# EAGLE design Power-Conversion (EAGLE 8.5.0)
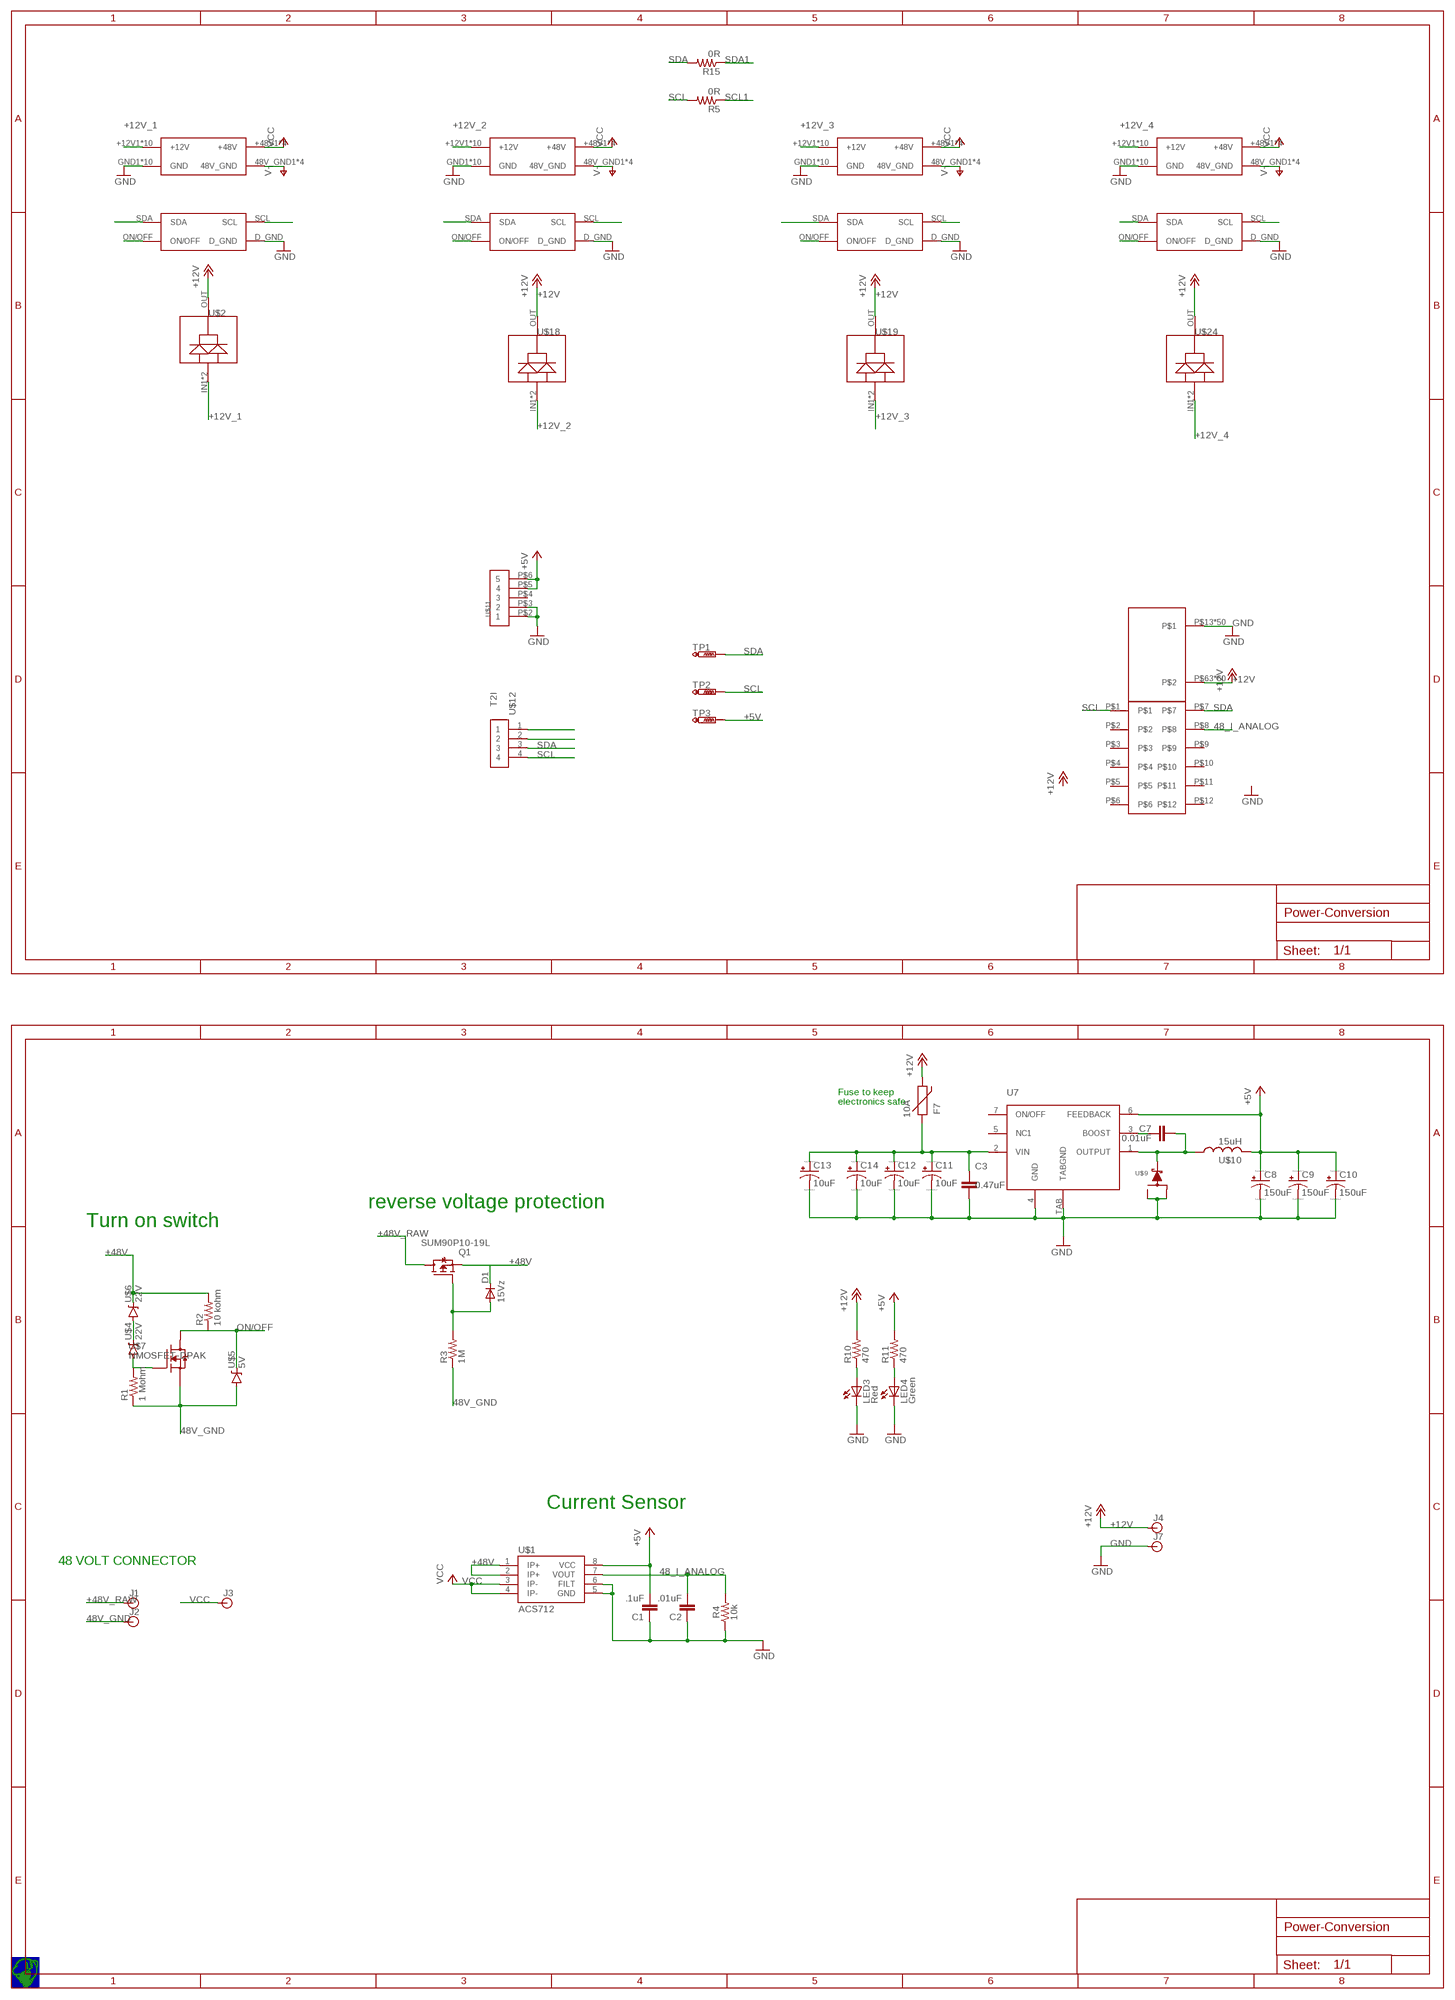
[diagram p0: schematic, sheet 1]

## Parts
C1  .1uF  4.7UF0603  [0603]
C2  .01uF  4.7UF0603  [0603]
C3  0.47uF  C-EUC0603  [C0603]
C7  0.01uF  CAP0603-CAP  [0603-CAP]
C8  150uF  C-TANTALUM(10UF_150UF)  [CTAN(7.30_4.30MM)]
C9  150uF  C-TANTALUM(10UF_150UF)  [CTAN(7.30_4.30MM)]
C10  150uF  C-TANTALUM(10UF_150UF)  [CTAN(7.30_4.30MM)]
C11  10uF  C-TANTALUM(10UF_150UF)  [CTAN(7.30_4.30MM)]
C12  10uF  C-TANTALUM(10UF_150UF)  [CTAN(7.30_4.30MM)]
C13  10uF  C-TANTALUM(10UF_150UF)  [CTAN(7.30_4.30MM)]
C14  10uF  C-TANTALUM(10UF_150UF)  [CTAN(7.30_4.30MM)]
D1  15Vz  DIODE-SOD123  [SOD123]
F7  10A  PTC(2920L)  [PTC-2920]
J1  BANANA_CONN  [BANANA_CONN]
J2  BANANA_CONN  [BANANA_CONN]
J3  BANANA_CONN  [BANANA_CONN]
J4  BANANA_CONN  [BANANA_CONN]
J7  BANANA_CONN  [BANANA_CONN]
LED3  Red  LED0603  [LED-0603]
LED4  Green  LED0603  [LED-0603]
Q1  SUM90P10-19L  SPB80P06P  [TO263]
R1  1 Mohm  RESISTOR0603-RES  [0603-RES]
R2  10 kohm  RESISTOR0603-RES  [0603-RES]
R3  1M  R-US_R0603  [R0603]
R4  10k  10KOHM-0603-1/10W-1%  [0603]
R5  0R  R-US_R0603  [R0603]
R10  470  R-US_R0603  [R0603]
R11  470  R-US_R0603  [R0603]
R15  0R  R-US_R0603  [R0603]
TP1  PTR1PAD1-13  [P1-13]
TP2  PTR1PAD1-13  [P1-13]
TP3  PTR1PAD1-13  [P1-13]
U7  LM2678  [LM2678]
U$1  ACS712  [SO08]
U$2  DIODE  [DIODE]
U$4  22V  ZENER-SOT23  [SOT23-3]
U$5  5V  ZENER-SOT23  [SOT23-3]
U$6  22V  ZENER-SOT23  [SOT23-3]
U$7  NMOSFET-DPAK  [DPAK]
U$8  ESC-FULL  [ESC-FULL]
U$9  SWITCHMODE_SCHOTTKY  [DPAK-3]
U$10  15uH  HCMA1305  [HCMA1305]
U$11  T2I5P  [T2I5P]
U$12  T2I  [T2I]
U$18  DIODE  [DIODE]
U$19  DIODE  [DIODE]
U$20  BRICK_TO_POWER_DIST_WHOLE  [BRICK_TO_POWER_DIST_WHOLE]
U$21  BRICK_TO_POWER_DIST_WHOLE  [BRICK_TO_POWER_DIST_WHOLE]
U$22  BRICK_TO_POWER_DIST_WHOLE  [BRICK_TO_POWER_DIST_WHOLE]
U$23  BRICK_TO_POWER_DIST_WHOLE  [BRICK_TO_POWER_DIST_WHOLE]
U$24  DIODE  [DIODE]

## Nets
48_I_ANALOG: C2.2 R4.2 U$1.7(VOUT) U$8.P$8
48V_GND: J2.P$1 R1.1 R3.1 U$5.1(A) U$7.3(S) U$20.48V_GND1(48V_GND) U$20.48V_GND2(48V_GND) U$20.48V_GND3(48V_GND) U$20.48V_GND4(48V_GND) U$21.48V_GND1(48V_GND) U$21.48V_GND2(48V_GND) U$21.48V_GND3(48V_GND) U$21.48V_GND4(48V_GND) U$22.48V_GND1(48V_GND) U$22.48V_GND2(48V_GND) U$22.48V_GND3(48V_GND) U$22.48V_GND4(48V_GND) U$23.48V_GND1(48V_GND) U$23.48V_GND2(48V_GND) U$23.48V_GND3(48V_GND) U$23.48V_GND4(48V_GND) ; supply symbol labelled V-
+5V: C1.2 C8.+ C9.+ C10.+ R11.2 TP3.TP U7.6(FEEDBACK) U$1.8(VCC) U$10.P$2 U$11.P$5 U$11.P$6
+12V: F7.2 J4.P$1 R10.2 U$2.OUT U$8.P$63 U$8.P$64 U$8.P$65 U$8.P$66 U$8.P$67 U$8.P$68 U$8.P$69 U$8.P$70 U$8.P$71 U$8.P$72 U$8.P$73 U$8.P$74 U$8.P$75 U$8.P$76 U$8.P$77 U$8.P$78 U$8.P$79 U$8.P$80 U$8.P$81 U$8.P$82 U$8.P$83 U$8.P$84 U$8.P$85 U$8.P$86 U$8.P$87 U$8.P$88 U$8.P$89 U$8.P$90 U$8.P$91 U$8.P$92 U$8.P$101 U$8.P$102 U$8.P$103 U$8.P$104 U$8.P$105 U$8.P$106 U$8.P$107 U$8.P$108 U$8.P$109 U$8.P$110 U$8.P$111 U$8.P$112 U$8.P$113 U$8.P$114 U$8.P$115 U$8.P$116 U$8.P$117 U$8.P$118 U$8.P$119 U$8.P$120 U$8.P$121 U$8.P$122 U$8.P$123 U$8.P$124 U$8.P$125 U$8.P$126 U$8.P$127 U$8.P$128 U$8.P$129 U$8.P$130 U$18.OUT U$19.OUT U$24.OUT
+12V_1: U$2.IN1(IN2) U$2.IN2 U$20.+12V1(+12V) U$20.+12V2(+12V) U$20.+12V3(+12V) U$20.+12V4(+12V) U$20.+12V5(+12V) U$20.+12V6(+12V) U$20.+12V7(+12V) U$20.+12V8(+12V) U$20.+12V9(+12V) U$20.+12V10(+12V)
+12V_2: U$18.IN1(IN2) U$18.IN2 U$21.+12V1(+12V) U$21.+12V2(+12V) U$21.+12V3(+12V) U$21.+12V4(+12V) U$21.+12V5(+12V) U$21.+12V6(+12V) U$21.+12V7(+12V) U$21.+12V8(+12V) U$21.+12V9(+12V) U$21.+12V10(+12V)
+12V_3: U$19.IN1(IN2) U$19.IN2 U$22.+12V1(+12V) U$22.+12V2(+12V) U$22.+12V3(+12V) U$22.+12V4(+12V) U$22.+12V5(+12V) U$22.+12V6(+12V) U$22.+12V7(+12V) U$22.+12V8(+12V) U$22.+12V9(+12V) U$22.+12V10(+12V)
+12V_4: U$23.+12V1(+12V) U$23.+12V2(+12V) U$23.+12V3(+12V) U$23.+12V4(+12V) U$23.+12V5(+12V) U$23.+12V6(+12V) U$23.+12V7(+12V) U$23.+12V8(+12V) U$23.+12V9(+12V) U$23.+12V10(+12V) U$24.IN1(IN2) U$24.IN2
+48V: D1.C Q1.2(S) R2.2 U$1.1(IP+) U$1.2(IP+) U$6.3(C)
+48V_RAW: J1.P$1 Q1.3(D)
GND: C1.1 C2.1 C3.2 C8.- C9.- C10.- C11.- C12.- C13.- C14.- J7.P$1 LED3.C LED4.C R4.1 U7.4(GND) U7.TAB(TABGND) U$1.5(GND) U$1.6(FILT) U$8.P$13 U$8.P$14 U$8.P$15 U$8.P$16 U$8.P$17 U$8.P$18 U$8.P$19 U$8.P$20 U$8.P$21 U$8.P$22 U$8.P$23 U$8.P$24 U$8.P$25 U$8.P$26 U$8.P$27 U$8.P$28 U$8.P$29 U$8.P$30 U$8.P$31 U$8.P$32 U$8.P$33 U$8.P$34 U$8.P$35 U$8.P$36 U$8.P$37 U$8.P$38 U$8.P$39 U$8.P$40 U$8.P$41 U$8.P$42 U$8.P$43 U$8.P$44 U$8.P$45 U$8.P$46 U$8.P$47 U$8.P$48 U$8.P$49 U$8.P$50 U$8.P$51 U$8.P$52 U$8.P$53 U$8.P$54 U$8.P$55 U$8.P$56 U$8.P$57 U$8.P$58 U$8.P$59 U$8.P$60 U$8.P$61 U$8.P$62 U$9.P$1 U$9.P$3 U$11.P$2 U$11.P$3 U$20.D_GND U$20.GND1(GND) U$20.GND2(GND) U$20.GND3(GND) U$20.GND4(GND) U$20.GND5(GND) U$20.GND6(GND) U$20.GND7(GND) U$20.GND8(GND) U$20.GND9(GND) U$20.GND10(GND) U$21.D_GND U$21.GND1(GND) U$21.GND2(GND) U$21.GND3(GND) U$21.GND4(GND) U$21.GND5(GND) U$21.GND6(GND) U$21.GND7(GND) U$21.GND8(GND) U$21.GND9(GND) U$21.GND10(GND) U$22.D_GND U$22.GND1(GND) U$22.GND2(GND) U$22.GND3(GND) U$22.GND4(GND) U$22.GND5(GND) U$22.GND6(GND) U$22.GND7(GND) U$22.GND8(GND) U$22.GND9(GND) U$22.GND10(GND) U$23.D_GND U$23.GND1(GND) U$23.GND2(GND) U$23.GND3(GND) U$23.GND4(GND) U$23.GND5(GND) U$23.GND6(GND) U$23.GND7(GND) U$23.GND8(GND) U$23.GND9(GND) U$23.GND10(GND)
N$1: C3.1 C11.+ C12.+ C13.+ C14.+ F7.1 U7.2(VIN)
N$2: U$12.1
N$3: U$12.2
N$5: D1.A Q1.1(G) R3.2
N$9: U$4.3(C) U$6.1(A)
N$10: R1.2 U$4.1(A) U$7.1(G)
N$25: C7.1 U7.3(BOOST)
N$36: C7.2 U7.1(OUTPUT) U$9.P$4 U$10.P$1
N$39: LED3.A R10.1
N$40: LED4.A R11.1
ON/OFF: R2.1 U$5.3(C) U$7.4(D1) U$20.ON/OFF U$21.ON/OFF U$22.ON/OFF U$23.ON/OFF
SCL: R5.2 TP2.TP U$8.P$1 U$12.4
SCL1: R5.1 U$20.SCL U$21.SCL U$22.SCL U$23.SCL
SDA: R15.2 TP1.TP U$8.P$7 U$12.3
SDA1: R15.1 U$20.SDA U$21.SDA U$22.SDA U$23.SDA
VCC: J3.P$1 U$1.3(IP-) U$1.4(IP-) U$20.+48V1(+48V) U$20.+48V2(+48V) U$20.+48V3(+48V) U$20.+48V4(+48V) U$21.+48V1(+48V) U$21.+48V2(+48V) U$21.+48V3(+48V) U$21.+48V4(+48V) U$22.+48V1(+48V) U$22.+48V2(+48V) U$22.+48V3(+48V) U$22.+48V4(+48V) U$23.+48V1(+48V) U$23.+48V2(+48V) U$23.+48V3(+48V) U$23.+48V4(+48V)
Unconnected: U7.5(NC1) U7.7(ON/OFF) U$8.P$2 U$8.P$3 U$8.P$4 U$8.P$5 U$8.P$6 U$8.P$9 U$8.P$10 U$8.P$11 U$8.P$12 U$11.P$4

## Notes on the sheet
- Fuse to keep 
  electronics safe
- reverse voltage protection
- Turn on switch
- Current Sensor
- 48 VOLT CONNECTOR
- /Users/kingj/Desktop/kirby.bmp

## Library data of the parts
C1 C2 = SparkFun-Capacitors:4.7UF: 4.7µF ceramic capacitors A capacitor is a passive two-terminal electrical component used to store electrical energy temporarily in an electric field.; PROD_ID: CAP-08280; VALUE: 4.7uF
C3 = rcl:C-EU: CAPACITOR, European symbol
C7 = SparkFun-Passives:CAP: Capacitor Standard 0603 ceramic capacitor, and 0.1" leaded capacitor.
C8-C14 = PowerComponents:C-TANTALUM(10UF_150UF)
D1 = diode:DIODE-: DIODE; BOM: INCLUDE; PARTNO: MMSZ5245BFSCT-ND
F7 = PowerComponents:PTC(2920L)
J1-J4 J7 = SparkFun-Connectors:BANANA_CONN: Through-hole Banana Jack Basic PTH connection for banana jack plugs SparkFun Products: Multimeter Kit <https://www.sparkfun.com/products/retired/10956> Banana to Alligator Cable <https://www.sparkfun.com/products/retired/509> Banana to Alligator Coax Cable <https://www.sparkfun.com/products/retired/508> Banana to Banana Cable <https://www.sparkfun.com/products/retired/507> Banana to IC Hook Cables <https://www.sparkfun.com/products/retired/506>
LED3 LED4 = SparkFun:LED: LEDs Standard schematic elements and footprints for 5mm, 3mm, 1206, and 0603 sized LEDs. 5mm - Spark Fun Electronics SKU : COM-00529 (and others)
Q1 = transistor-fet:SPB80P06P: SIPMOS (R) Power-Transistor P-Channel, Enhancement mode Source: http://www.infineon.com/upload/Document/cmc_upload/documents/011/3685/SPP80P06P.pdf; BOM: INCLUDE; PARTNO: SUM90P10-19L-E3CT-ND
R1 R2 = SparkFun-Passives:RESISTOR: Resistor Basic schematic elements and footprints for 0603, 1206, and PTH resistors.
R3 = resistor:R-US_: RESISTOR, American symbol; BOM: INCLUDE; PARTNO: 1.00MHCT-ND
R4 = SparkFun-Resistors:10KOHM: 10kΩ resistor A resistor is a passive two-terminal electrical component that implements electrical resistance as a circuit element. Resistors act to reduce current flow, and, at the same time, act to lower voltage levels within circuits. - Wikipedia; PROD_ID: RES-00824
R5 R10 R11 R15 = resistor:R-US_: RESISTOR, American symbol
TP1-TP3 = testpad:PTR1: TEST PIN
U7 = PowerComponents:LM2678: LM2678 Buck Converter IC 12V-to-5V
U$1 = SparkFun-Sensors:ACS712: ACS712 Hall-effect-based isolated linear current sensor Datasheet <http://www.sparkfun.com/datasheets/BreakoutBoards/0712.pdf> SparkFun Products SparkFun Low Current Sensor Breakout - ACS712 <https://www.sparkfun.com/products/8883> (SEN-08883); PROD_ID: IC-08964
U$2 U$18 U$19 = diode:DIODE
U$4 U$6 = MotherboardParts:ZENER-SOT23; PN-DIGI: BZX84C22LT1GOSCT-ND
U$5 = MotherboardParts:ZENER-SOT23
U$7 = MotherboardParts:NMOSFET-DPAK; PN-DIGI: 497-4329-1-ND; VDSS: 60V
U$8 = MotherboardParts:ESC-FULL
U$9 = PowerComponents:SWITCHMODE_SCHOTTKY: {Digi-Key Part Number: MBRD835LT4GOSCT-ND} {Voltage - DC Reverse (Vr) (Max): 35V} {Current - Average Rectified (Io): 8A} {Voltage - Forward (Vf) (Max) @ If: 510mV @ 8A} {Speed: Fast Recovery =< 500ns, > 200mA (Io)} {Current - Reverse Leakage @ Vr: 1.4mA @ 35V} {Mounting Type: Surface Mount} {Package / Case: TO-252-3, DPak (2 Leads + Tab), SC-63} {Supplier Device Package: DPAK-3} {Operating Temperature - Junction: -65°C ~ 150°C}
U$10 = DiscreteComponents:HCMA1305
U$11 = BackplaneParts:T2I5P
U$12 = BackplaneParts:T2I
U$20-U$23 = MotherBoardParts2:BRICK_TO_POWER_DIST_WHOLE
U$24 = diode:DIODE; SPICEPREFIX: B

## Net classes
1 power: width 0.254 mm

## Board
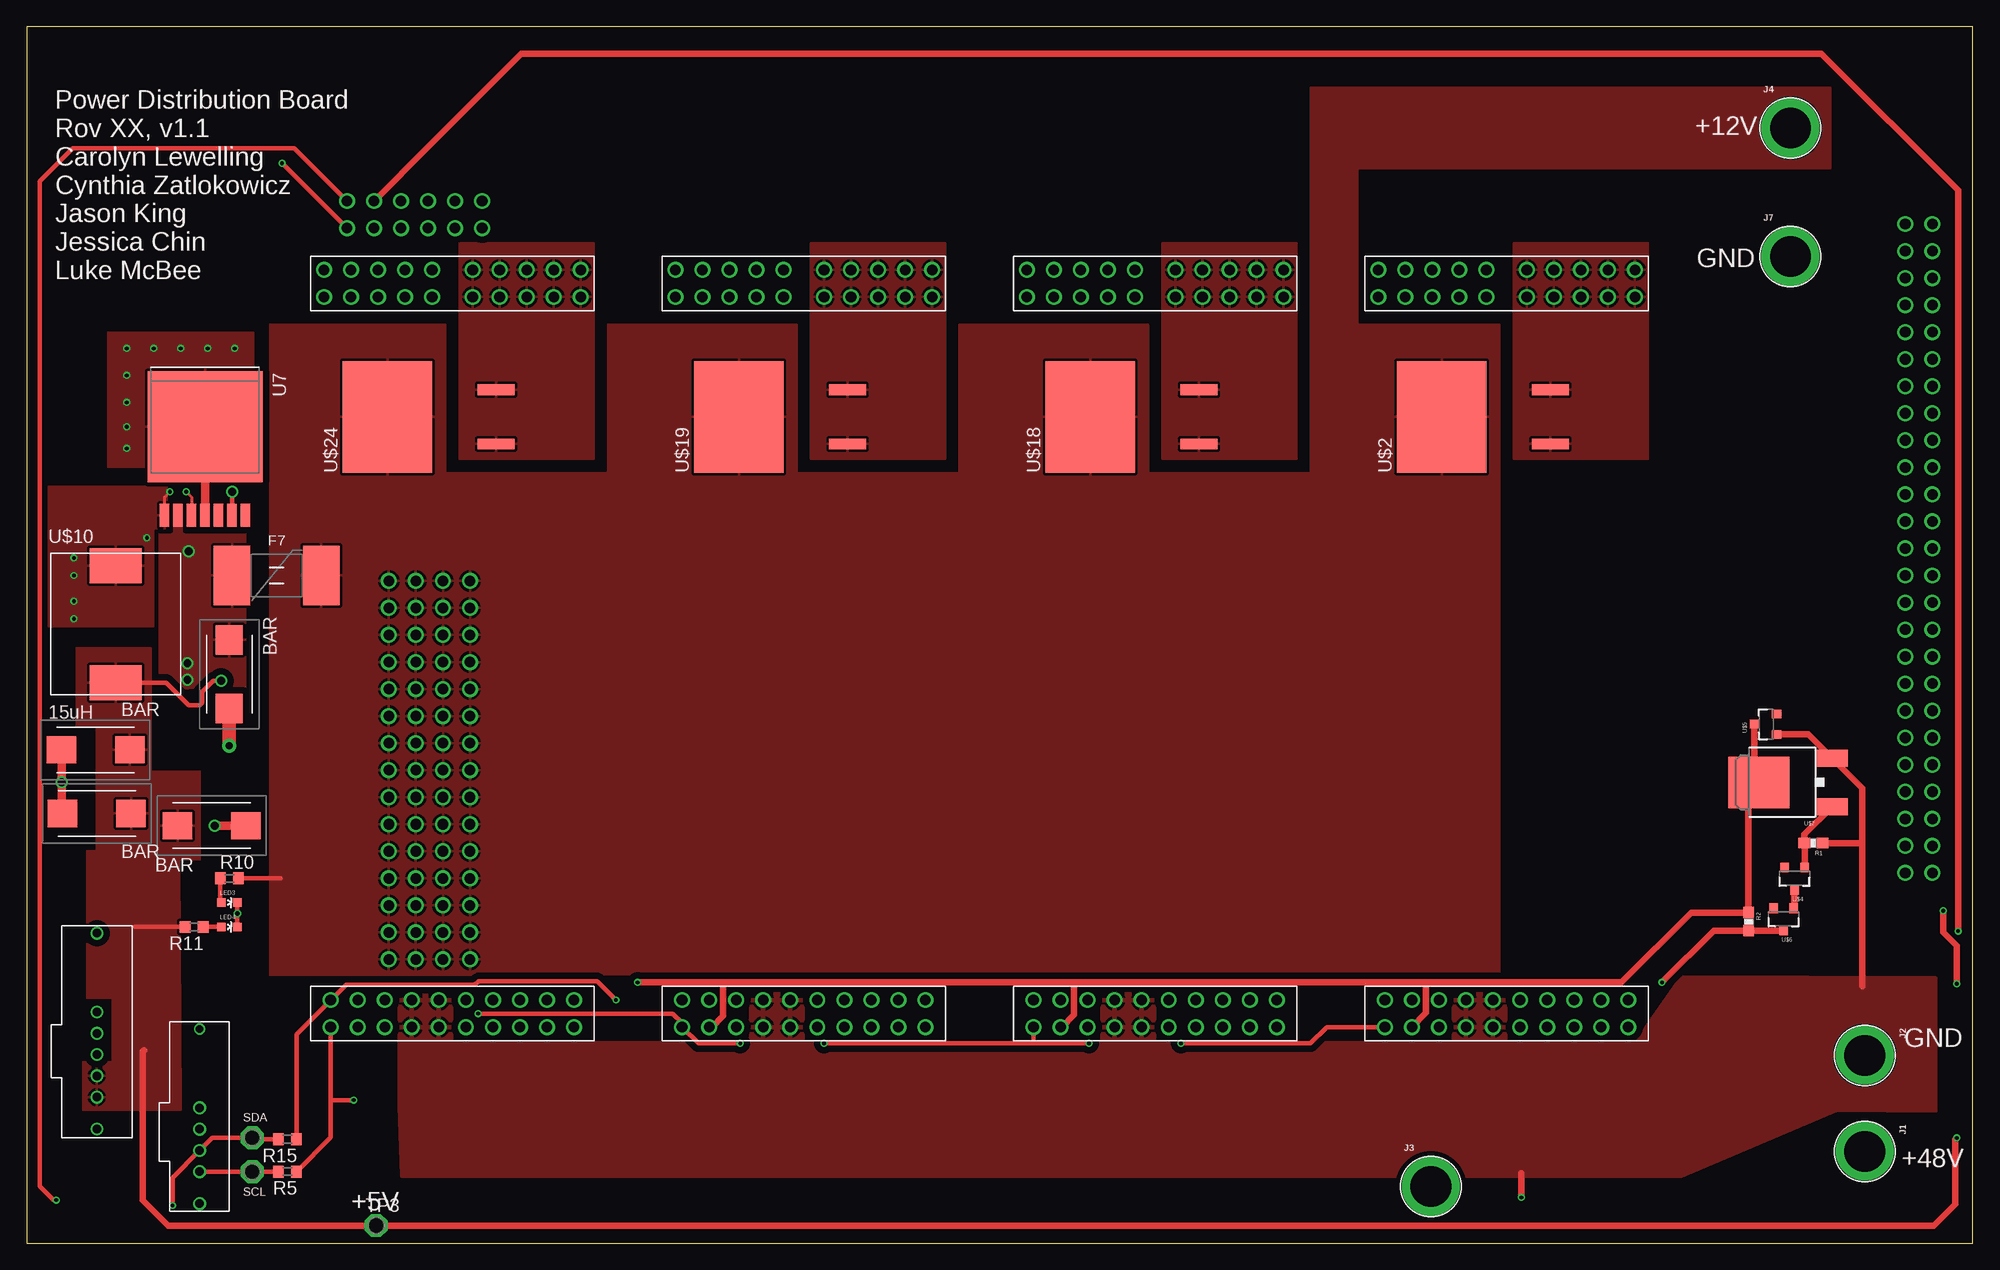
[diagram p1: board, top side]
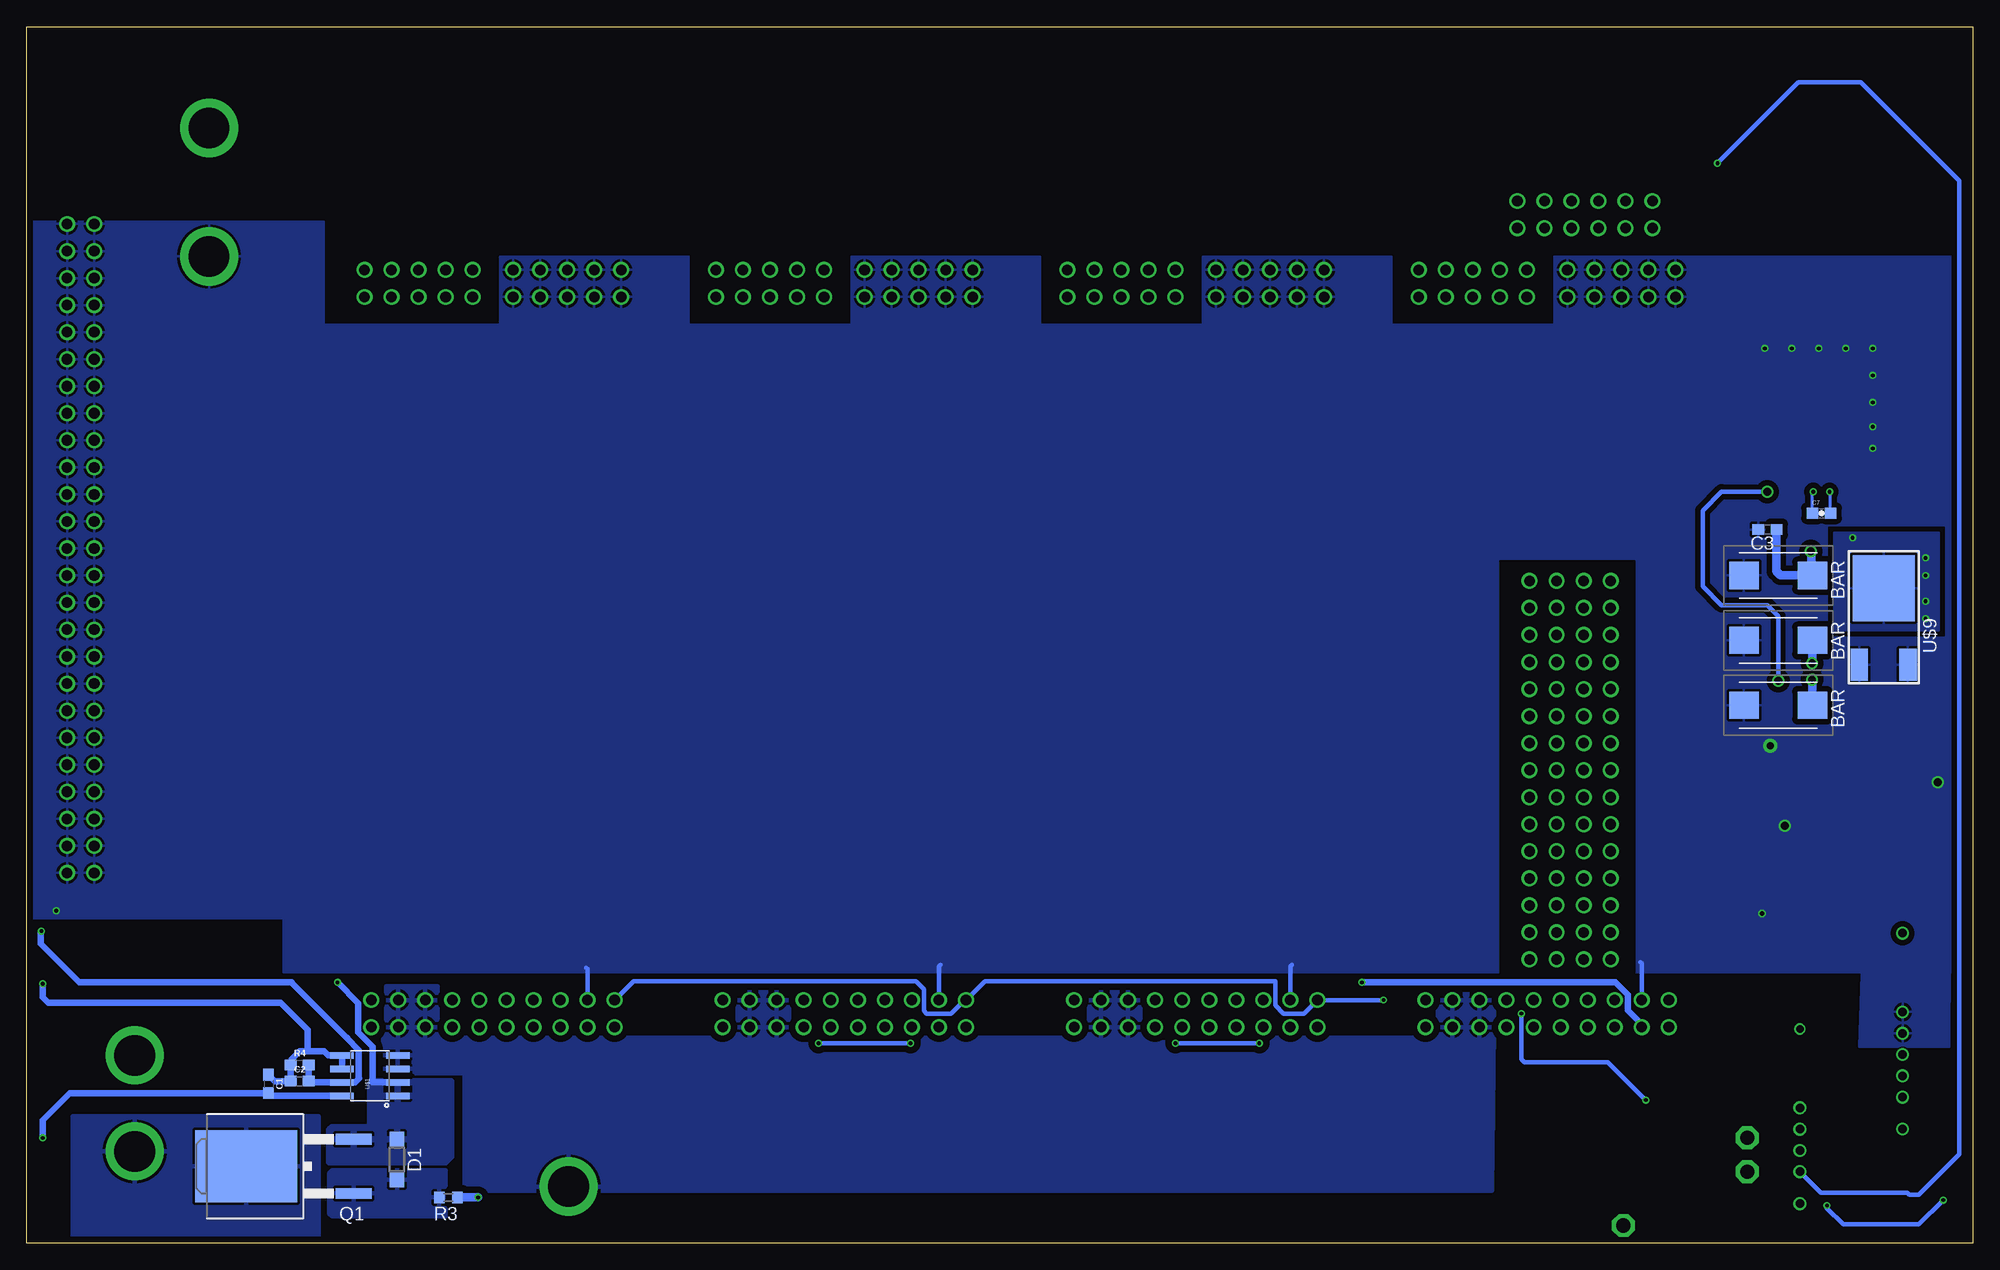
[diagram p2: board, bottom side, seen from below]

Size 182.88 x 114.3 mm. Coordinates in mm from the lower left corner, seen from the top.
Outline: 0,0 182.88,0 182.88,114.3 0,114.3 0,0
Copper layers (1*16): Top 0.035mm / dielectric 1.6mm / Bottom 0.035mm
Design rules "Elecrow_2-layer_PCB_eagle_rule": minimum track width 6mil, minimum drill 12mil, track to track 6mil, track to pad 6mil, pad to pad 6mil, via to via 8mil, smd to smd 0mil, copper to edge 20mil, drill to drill 10mil, minimum pad ring 6mil, minimum via ring 6mil, stop-mask expansion 0mil, vias tented up to drill 100mil, thermal gap 10mil

### Footprints (pad centres in the part's own frame; a part is rotated, then mirrored left to right if it is on the bottom)
0603 = smd 1.1 x 1: 1 -0.85,0; 2 0.85,0
C0603 = smd 1.1 x 1: 1 -0.85,0; 2 0.85,0
0603-CAP = smd 1.1 x 1: 1 -0.85,0; 2 0.85,0
CTAN(7.30_4.30MM) = smd 2.77 x 2.55: + -3.22,0; - 3.22,0
SOD123 = smd 1.4 x 1.4: A 1.9,0; C -1.9,0
PTC-2920 = smd 3.4 x 5.6: 1 -4.2,0; 2 4.2,0
BANANA_CONN = drill 3.81 pad 5.461: P$1 0,0
LED-0603 = smd 0.8 x 0.8: A 0,-0.75; C 0,0.75
TO263 = smd 1 x 3.4: 1 -2.54,-6.6; 2 2.54,-6.6 | smd 6.8 x 9.6: 3 0,3.5
0603-RES = smd 1.1 x 1: 1 -0.85,0; 2 0.85,0
R0603 = smd 1 x 1.1: 1 -0.85,0; 2 0.85,0
P1-13 = drill 1.321 pad 2.159 octagon: TP 0,0
LM2678 = smd 2.159 x 0.914: 1 8.331,-3.81; 2 8.331,-2.54; 3 8.331,-1.27; 4 8.331,0; 5 8.331,1.27; 6 8.331,2.54; 7 8.331,3.81 | smd 10.414 x 10.795: TAB 0,0
SO08 = smd 0.61 x 2.21: 1 -1.905,-2.616; 2 -0.635,-2.616; 3 0.635,-2.616; 4 1.905,-2.616; 5 1.905,2.616; 6 0.635,2.616; 7 -0.635,2.616; 8 -1.905,2.616
DIODE = smd 1.016 x 3.504: IN1 2.705,-6.023; IN2 7.785,-6.023 | smd 10.49 x 8.38: OUT 5.245,4.19
SOT23-3 = smd 0.8 x 0.9: 1 -0.95,-1; 2 0.95,-1; 3 0,1.1
DPAK = smd 1.6 x 3: 1 -2.28,-5.31; 3 2.28,-5.31 | smd 4.826 x 5.715: 4 0,1.588
ESC-FULL = drill 1: P$1 -6.35,-1.27; P$2 -3.81,-1.27; P$3 -1.27,-1.27; P$4 1.27,-1.27; P$5 3.81,-1.27; P$6 6.35,-1.27; P$7 -6.35,1.27; P$8 -3.81,1.27; P$9 -1.27,1.27; P$10 1.27,1.27; P$11 3.81,1.27; P$12 6.35,1.27; P$13 140.081,-61.849; P$14 142.621,-61.849; P$15 140.081,-59.309; P$16 142.621,-59.309; P$17 140.081,-56.769; P$18 142.621,-56.769; P$19 140.081,-54.229; P$20 142.621,-54.229; P$21 140.081,-51.689; P$22 142.621,-51.689; P$23 140.081,-49.149; P$24 142.621,-49.149; P$25 140.081,-46.609; P$26 142.621,-46.609; P$27 140.081,-44.069; P$28 142.621,-44.069; P$29 140.081,-41.529; P$30 142.621,-41.529; P$31 140.081,-38.989; P$32 142.621,-38.989; P$33 140.081,-36.449; P$34 142.621,-36.449; P$35 140.081,-33.909; P$36 142.621,-33.909; P$37 140.081,-31.369; P$38 142.621,-31.369; P$39 140.081,-28.829; P$40 142.621,-28.829; P$41 140.081,-26.289; P$42 142.621,-26.289; P$43 140.081,-23.749; P$44 142.621,-23.749; P$45 140.081,-21.209; P$46 142.621,-21.209; P$47 140.081,-18.669; P$48 142.621,-18.669; P$49 140.081,-16.129; P$50 142.621,-16.129; P$51 140.081,-13.589; P$52 142.621,-13.589; P$53 140.081,-11.049; P$54 142.621,-11.049; P$55 140.081,-8.509; P$56 142.621,-8.509; P$57 140.081,-5.969; P$58 142.621,-5.969; P$59 140.081,-3.429; P$60 142.621,-3.429; P$61 140.081,-0.889; P$62 142.621,-0.889; P$63 2.667,-34.417; P$64 2.667,-36.957; P$65 2.667,-39.497; P$66 2.667,-42.037; P$67 2.667,-44.577; P$68 2.667,-47.117; P$69 2.667,-49.657; P$70 2.667,-52.197; P$71 2.667,-54.737; P$72 2.667,-57.277; P$73 2.667,-59.817; P$74 2.667,-62.357; P$75 2.667,-64.897; P$76 2.667,-67.437; P$77 2.667,-69.977; P$78 5.207,-34.417; P$79 5.207,-36.957; P$80 5.207,-39.497; P$81 5.207,-42.037; P$82 5.207,-44.577; P$83 5.207,-47.117; P$84 5.207,-49.657; P$85 5.207,-52.197; P$86 5.207,-54.737; P$87 5.207,-57.277; P$88 5.207,-59.817; P$89 5.207,-62.357; P$90 5.207,-64.897; P$91 5.207,-67.437; P$92 5.207,-69.977; P$101 -2.413,-34.417; P$102 -2.413,-36.957; P$103 -2.413,-39.497; P$104 -2.413,-42.037; P$105 -2.413,-44.577; P$106 -2.413,-47.117; P$107 -2.413,-49.657; P$108 -2.413,-52.197; P$109 -2.413,-54.737; P$110 -2.413,-57.277; P$111 -2.413,-59.817; P$112 -2.413,-62.357; P$113 -2.413,-64.897; P$114 -2.413,-67.437; P$115 -2.413,-69.977; P$116 0.127,-34.417; P$117 0.127,-36.957; P$118 0.127,-39.497; P$119 0.127,-42.037; P$120 0.127,-44.577; P$121 0.127,-47.117; P$122 0.127,-49.657; P$123 0.127,-52.197; P$124 0.127,-54.737; P$125 0.127,-57.277; P$126 0.127,-59.817; P$127 0.127,-62.357; P$128 0.127,-64.897; P$129 0.127,-67.437; P$130 0.127,-69.977
DPAK-3 = smd 3 x 1.6: P$1 4.08,-2.285; P$3 4.08,2.285 | smd 6.2 x 5.8: P$4 -3.1,0
HCMA1305 = smd 4.9 x 3.3: P$1 0,5.5; P$2 0,-5.5
T2I5P = drill 0.8: P$1 -19.1,3.3; P$2 -11.7,3.3; P$3 -9.7,3.3; P$4 -7.7,3.3; P$5 -5.7,3.3; P$6 -3.7,3.3; P$7 -0.7,3.3
T2I = drill 0.8: 1 8.1,2.8; 2 10.1,2.8; 3 12.1,2.8; 4 14.1,2.8; S2 17.1,2.8 | drill 0.7: S1 0.7,2.8
BRICK_TO_POWER_DIST_WHOLE = drill 1: 1 12.065,-49.53; 2 12.065,-52.07; 48V_GND1 4.445,-49.53; 48V_GND2 6.985,-49.53; 48V_GND3 4.445,-52.07; 48V_GND4 6.985,-52.07; +12V1 10.16,19.05; +12V2 12.7,19.05; +12V3 15.24,19.05; +12V4 17.78,19.05; +12V5 20.32,19.05; +12V6 10.16,16.51; +12V7 12.7,16.51; +12V8 15.24,16.51; +12V9 17.78,16.51; +12V10 20.32,16.51; +48V1 14.605,-49.53; +48V2 17.145,-49.53; +48V3 14.605,-52.07; +48V4 17.145,-52.07; D_GND -0.635,-49.53; GND1 -3.81,19.05; GND2 -1.27,19.05; GND3 1.27,19.05; GND4 3.81,19.05; GND5 6.35,19.05; GND6 -3.81,16.51; GND7 -1.27,16.51; GND8 1.27,16.51; GND9 3.81,16.51; GND10 6.35,16.51; ON/OFF -0.635,-52.07; P$3 1.905,-52.07; P$18 1.905,-49.53; P$31 9.525,-52.07; P$35 19.685,-52.07; P$36 9.525,-49.53; P$40 19.685,-49.53; SCL -3.175,-52.07; SDA -3.175,-49.53

### Placement (x,y rotation side)
C1  160.15,14.99 270 bottom
C2  157.23,15.24 0 bottom
C3  19.3,67.06 180 bottom
C7  14.22,68.58 0 bottom
C8  17.4,39.24 0 top
C9  6.48,46.35 180 top
C10  6.6,40.39 180 top
C11  18.29,56.64 180 bottom
C12  18.29,50.55 180 bottom
C13  18.29,62.74 180 bottom
C14  19.05,53.47 270 top
D1  148.08,7.87 270 bottom
F7  23.5,62.74 0 top
J1  172.72,8.64 270 top
J2  172.72,17.65 270 top
J3  131.95,5.33 0 top
J4  165.74,104.78 0 top
J7  165.74,92.71 0 top
LED3  19.05,32 270 top
LED4  19.05,29.72 270 top
Q1  158.75,7.24 90 bottom
R1  167.89,37.59 180 top
R2  161.8,30.23 270 top
R3  143.26,4.32 180 bottom
R4  157.23,16.76 0 bottom
R5  24.51,6.73 180 top
R10  19.05,34.29 0 top
R11  15.75,29.72 180 top
R15  24.51,9.78 180 top
TP1  21.21,9.91 0 top
TP2  21.21,6.73 0 top
TP3  32.84,1.68 0 top
U7  16.76,76.71 270 top
U$1  150.62,15.75 90 bottom
U$2  137.16,72.39 90 top
U$4  166.12,34.29 180 top
U$5  163.45,48.77 90 top
U$6  165.1,30.48 180 top
U$7  164.34,43.31 90 top
U$8  36.45,96.65 0 top
U$9  8.38,58.42 270 bottom
U$10  8.38,58.17 0 top
U$11  3.3,10.03 270 top
U$12  13.46,20.83 270 top
U$15  POWER_DIST_TO_ESC  [POWER_DIST_TO_ESC]  6.35,120.65 270 top  (outside the outline)
U$18  104.14,72.39 90 top
U$19  71.12,72.39 90 top
U$20  130.81,72.39 0 top
U$21  97.79,72.39 0 top
U$22  64.77,72.39 0 top
U$23  31.75,72.39 0 top
U$24  38.1,72.39 90 top

### Tracks (layer width: path | path; a pad name or v marks a point on that pad's centre or on a via)
48_I_ANALOG  (via drill 0.35)
  Top 0.61: v181.49,29.34 181.49,98.93 168.66,111.76 46.48,111.76 37.97,103.25 37.85,103.12 U$8.P$8
  Bottom 0.61: U$1.7 156.38,15.11 C2.2 R4.2 | U$1.7 152.27,15.11 | v181.49,29.34 181.56,29.34 181.56,28.14 177.93,24.51 157.99,24.51 157.99,24.46 152.78,19.25 | U$1.7 152.02,15.11 151.64,15.49 151.68,15.53 151.68,18.15 152.78,19.25 | 152.78,19.25 152.78,19.3
48V_GND  (via drill 0.35)
  Top 0.61: v140.46,4.32 140.46,6.6 | 172.47,37.47 172.47,24.13 | 172.47,37.47 172.47,42.77 169.91,45.32 U$7.3 167.42,47.82 U$5.1 | R1.1 172.34,37.59 172.47,37.47
  Bottom 0.813: R3.1 v140.46,4.32
  pour Top (isolate 0.61): 35.05,24.13 35.05,12.95 35.31,6.35 155.45,6.35 169.8,12.45 170.18,12.57 179.32,12.45 179.32,24.89 155.57,25.02 155.45,24.89 151.26,18.92 138.94,18.8 138.94,23.62 138.68,23.88 134.11,23.88 134.11,18.8 105.92,18.8 105.92,24.13 101.09,24.13 101.09,18.8 72.9,18.8 72.9,24.13 68.07,24.13 68.07,18.8 39.88,18.8 39.88,24.13
+5V  (via drill 0.35, 0.75)
  Top 0.406: U$10.P$2 13.12,52.67 15.24,50.55 16.26,50.55 16.51,50.8 16.51,51.82 17.53,52.83 v18.29,52.83 | v19.3,70.61 U7.6 | R11.2 10.16,29.72
  Top 0.61: v181.36,9.91 181.23,9.78 181.23,3.68 179.22,1.68 TP3.TP 13.31,1.68 10.92,4.06 10.92,18.03 11.05,18.16
  Bottom 0.406: v18.29,52.83 18.29,58.93 19.3,59.94 23.62,59.94 25.4,61.72 25.4,68.83 23.62,70.61 v19.3,70.61
  Bottom 0.61: U$1.8 159.81,13.84 C1.2 160.19,14.1 178.82,14.1 181.36,11.56 v181.36,9.91
  pour Top (isolate 0.61, rank 2): 4.7,55.88 11.68,55.88 11.68,44.32 16.26,44.32 16.26,36.07 14.35,36.07 14.48,12.57 5.33,12.57 5.33,16.99 8.08,16.99 8.08,23.09 5.71,23.09 5.71,36.83 6.6,36.83 6.6,48.51 4.7,48.51
+12V
  Top 0.406: R10.2 23.88,34.29
  pour Top (isolate 0.61): 22.86,86.36 39.37,86.36 39.37,72.39 54.61,72.39 54.61,86.36 72.39,86.36 72.39,72.39 87.63,72.39 87.63,86.36 105.41,86.36 105.41,72.39 120.65,72.39 120.65,86.36 138.43,86.36 138.43,25.4 22.86,25.15
  pour Top (isolate 0.61): 120.65,86.36 120.65,108.58 169.54,108.58 169.54,100.97 128.91,100.97 125.09,100.97 125.09,86.36 125.09,84.45 120.65,84.45
+12V_1
  pour Top (isolate 0.61, rank 2): 139.7,93.98 152.4,93.98 152.4,73.66 139.7,73.66
+12V_2
  pour Top (isolate 0.61, rank 2): 106.68,93.98 119.38,93.98 119.38,73.66 106.68,73.66
+12V_3
  pour Top (isolate 0.61, rank 2): 73.66,93.98 86.36,93.98 86.36,73.66 73.66,73.66
+12V_4
  pour Top (isolate 0.61, rank 2): 40.64,93.98 53.34,93.98 53.34,73.66 40.64,73.66
+48V  (via drill 0.35)
  Top 0.61: U$6.3 R2.2 158.53,29.38 v153.67,24.51
  Bottom 0.61: U$1.2 150.37,15.11 150.37,18.48 151.71,19.82 151.71,22.55 v153.67,24.51
  pour Bottom (isolate 0.61): 143.51,7.62 154.43,7.62 154.43,10.67 154.18,10.92 150.62,10.92 150.62,15.24 143,15.24 143,8.13
+48V_RAW
  pour Bottom (isolate 0.61): 155.45,0.25 178.56,0.25 178.56,11.94 155.45,11.94
GND  (via drill 0.35, 0.4, 0.65 pad 1.3, 0.75)
  Top 0.406: LED3.C v19.8,31 v19.81,30.99 19.8,30.98 LED4.C
  Top 0.61: v180.09,31.24 180.09,29.21 181.36,27.94 v181.36,24.38
  Top 0.813: U7.4 U7.TAB | v17.65,39.24 C8.- | C9.- 3.3,46.35 v3.3,43.31 3.3,40.39 C10.-
  Top 1.27: C14.- v19.05,46.74
  Bottom 0.406: U$20.D_GND 130.18,25.78 130.3,25.91 | U$21.D_GND 97.16,26.04 97.03,26.16 | U$22.D_GND 64.14,26.04 64.01,26.16 | U$23.D_GND 31.11,26.29 31.24,26.42
  Bottom 0.61: U$1.6 U$1.5 154.56,17.65 154.94,18.03 156.46,18.03 | v181.36,24.38 181.36,23.11 180.85,22.61 159,22.61 156.46,20.07 156.46,18.03 | 156.46,18.03 157.23,18.03 157.99,17.27 157.99,16.85 R4.1 C2.1 159.55,15.24 C1.1
  other vias: 9.4,74.68 9.4,76.71 9.4,78.99 9.4,81.53 9.4,84.07 11.94,84.07 14.48,84.07 17.02,84.07 19.56,84.07
  pour Bottom (isolate 0.508, rank 6): 0,92.71 39.37,92.71 39.37,86.36 54.61,86.36 54.61,92.71 72.39,92.71 72.39,86.36 87.63,86.36 87.63,92.71 105.41,92.71 105.41,86.36 120.65,86.36 120.65,92.71 138.43,92.71 138.43,86.36 158.75,86.36 158.75,25.4 0,25.4
  pour Top: 7.62,85.6 7.62,72.9 21.34,72.9 21.34,85.6
  pour Bottom (rank 6): 2.21,18.47 10.67,18.47 10.39,26.64 2.16,26.72
  pour Bottom (isolate 0.61): 182.63,96.01 154.94,96.01 154.94,30.48 182.63,30.48
N$1  (via drill 0.75)
  Bottom 0.813: v15.11,54.48 15.11,56.64 C11.+ | v15.11,52.96 15.07,52.96 C12.+ | v15.24,65.02 15.07,63.12 C13.+ 18.07,62.74 18.45,63.12 C3.1
  pour Top (isolate 0.61): 12.45,66.93 20.57,66.8 20.57,52.2 12.45,52.07
  pour Top (no thermals): 13.84,66.04 14.61,66.04 14.61,68.33 13.84,68.33
N$4
  cutout Bottom: 31.75,24.77 31.75,64.14 44.45,64.14 44.45,24.77
N$5
  pour Bottom (isolate 0.61): 143.51,6.86 154.18,6.86 154.43,6.6 154.43,2.79 154.18,2.54 143.51,2.54
N$9
  Top 0.61: U$4.3 166.12,31.55 U$6.1
N$10
  Top 0.61: U$7.1 167.04,38.42 R1.2 167.07,37.57 U$4.1
N$25  (via drill 0.35)
  Top 0.305: v14.99,70.61 15.49,70.1 U7.3
  Bottom 0.305: C7.1 15.07,70.52 v14.99,70.61
N$36  (via drill 0.35)
  Top 0.305: U7.1 12.95,70.1 v13.46,70.61
  Bottom 0.305: v13.46,70.61 13.46,68.67 C7.2
  other vias: 11.3,66.29 4.45,58.67 4.45,60.33 4.45,62.74 4.45,64.39
  pour Top (isolate 0.406, rank 5): 2.03,57.91 2.03,71.12 13.21,71.12 13.21,66.8 11.94,66.8 11.94,57.91
  pour Bottom (rank 3): 3.17,57.53 13.08,57.53 13.08,66.8 3.17,66.8
N$39
  Top 0.406: R10.1 18.2,32.1 LED3.A
N$40
  Top 0.406: R11.1 LED4.A
ON/OFF  (via drill 0.35)
  Top 0.61: U$5.3 162.35,43.71 U$7.4 161.8,42.35 R2.1 156.43,31.08 149.86,24.51 131.44,24.51 | U$20.ON/OFF 131.5,21.65 131.5,24.45 131.44,24.51 | 131.44,24.51 98.42,24.51 | 98.42,24.51 65.53,24.51 | 65.53,24.51 v57.4,24.51 | U$21.ON/OFF 97.28,20.32 98.42,21.46 98.42,24.51 | U$22.ON/OFF 64.39,20.32 65.46,21.39 65.46,24.44 65.53,24.51
  Bottom 0.61: v57.4,24.51 33.59,24.51 32.44,23.36 32.44,21.9 31.11,20.57 U$23.ON/OFF
SCL  (via drill 0.35)
  Top 0.406: U$8.P$1 v24,101.47 | R5.2 TP2.TP U$12.4
  Bottom 0.406: U$12.4 14.29,4.76 6.18,4.76 6,4.57 5.08,4.57 1.27,8.38 1.27,99.82 10.54,109.09 16.38,109.09 v24,101.47
SCL1  (via drill 0.35)
  Top 0.406: v42.42,21.59 60.71,21.59 61.59,20.7 U$22.SCL 63.12,18.8 v67.06,18.8 | v74.93,18.8 94.49,18.8 | U$21.SCL 94.61,18.92 94.49,18.8 | v108.46,18.8 120.65,18.8 122.17,20.32 U$20.SCL | 94.49,18.8 v99.82,18.8 | U$23.SCL 28.57,13.46 | 28.57,13.46 v30.73,13.46 | 28.57,13.46 28.57,9.95 R5.1
  Bottom 0.406: v30.73,13.46 34.29,17.02 42.16,17.02 42.42,17.27 v42.42,21.59 | v67.06,18.8 v74.93,18.8 | v99.82,18.8 v108.46,18.8
SDA  (via drill 0.35)
  Top 0.406: v13.72,3.56 13.72,6.18 U$12.3 17.44,9.91 TP1.TP 21.34,9.78 R15.2 | v2.79,4.06 2.54,4.06 1.22,5.38 1.22,99.77 4.32,102.87 25.15,102.87 U$8.P$7
  Bottom 0.406: v13.72,3.56 13.72,3.3 12.19,1.78 5.08,1.78 v2.79,4.06
SDA1  (via drill 0.35)
  Top 0.406: v55.37,22.86 53.59,24.64 42.46,24.64 42.12,24.29 30,24.29 U$23.SDA 25.36,19.65 R15.1
  Bottom 0.406: U$20.SDA 125.86,24.64 99.31,24.64 98.55,23.88 98.55,21.84 98.3,21.59 96.01,21.59 94.74,22.86 U$21.SDA 92.84,24.64 65.53,24.64 65.53,22.35 64.77,21.59 62.87,21.59 U$22.SDA v55.37,22.86
VCC
  pour Bottom (isolate 0.61): 141.73,16 149.61,16 149.61,19.05 149.1,19.56 149.1,24.13 144.27,24.13 144.27,19.05 144.02,19.3 116.08,19.3 116.08,23.88 115.82,24.13 111.51,24.13 111.25,23.88 111.25,19.3 83.06,19.3 83.06,24.13 78.23,24.13 78.23,19.3 50.29,19.3 50.29,23.88 44.96,23.88 45.21,4.95 141.73,4.95

### Text on the board
tPlace: +12V | GND | Power Distribution Board / Rov XX, v1.1 / Carolyn Lewelling / Cynthia Zatlokowicz / Jason King / Jessica Chin / Luke McBee | BAR | BAR | BAR | BAR | GND | +48V | +5V
bPlace: BAR | BAR | BAR
tNames: SDA | SCL